# EAGLE design gameboy_esp_osc (EAGLE 8.4.3)
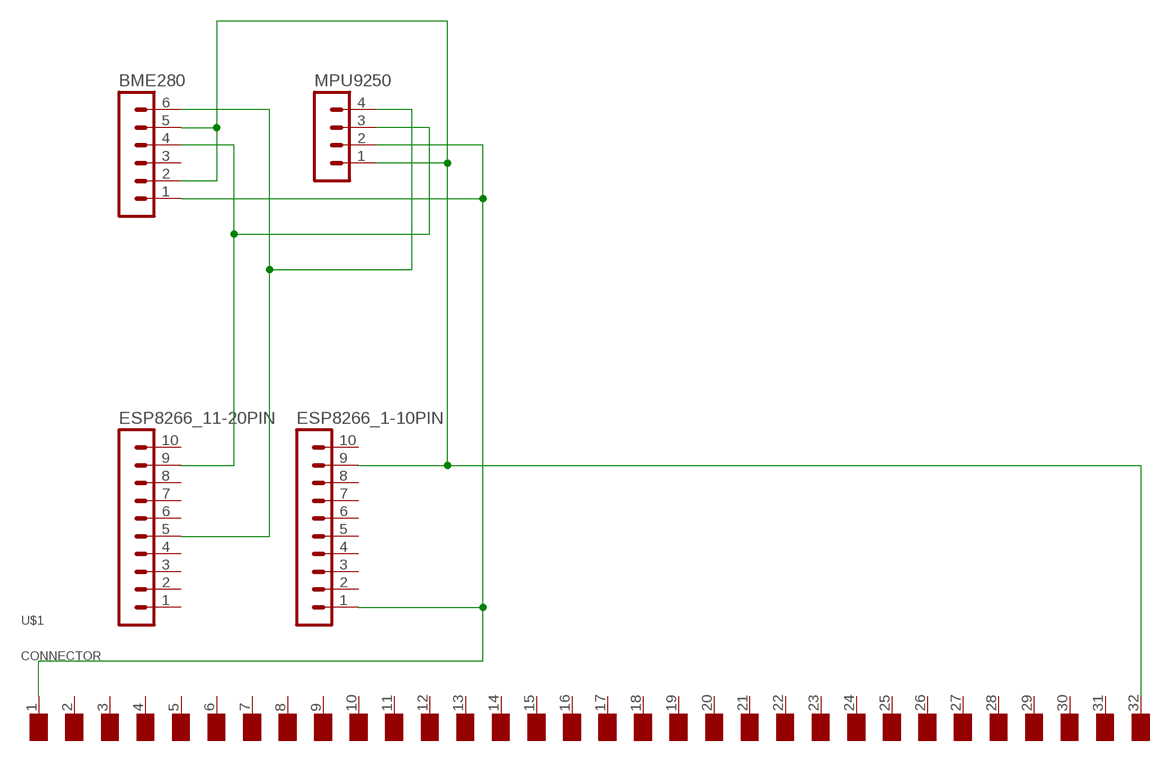
[diagram p0: schematic, sheet 1]

## Parts
BME280  MA06-1  [MA06-1]
ESP8266_1-10PIN  MA10-1  [MA10-1]
ESP8266_11-20PIN  MA10-1  [MA10-1]
MPU9250  MA04-1  [MA04-1]
U$1  CONNECTOR  [CONNECTOR]

## Nets
N$1: BME280.1 ESP8266_1-10PIN.1 MPU9250.2 U$1.1(VDD)
N$2: BME280.2 BME280.5 ESP8266_1-10PIN.9 MPU9250.1 U$1.32(GND)
N$3: BME280.4 ESP8266_11-20PIN.9 MPU9250.3
N$4: BME280.6 ESP8266_11-20PIN.5 MPU9250.4
Unconnected: BME280.3 ESP8266_1-10PIN.2 ESP8266_1-10PIN.3 ESP8266_1-10PIN.4 ESP8266_1-10PIN.5 ESP8266_1-10PIN.6 ESP8266_1-10PIN.7 ESP8266_1-10PIN.8 ESP8266_1-10PIN.10 ESP8266_11-20PIN.1 ESP8266_11-20PIN.2 ESP8266_11-20PIN.3 ESP8266_11-20PIN.4 ESP8266_11-20PIN.6 ESP8266_11-20PIN.7 ESP8266_11-20PIN.8 ESP8266_11-20PIN.10 U$1.2(NC) U$1.3(/WR) U$1.4(/RD) U$1.5(/RCS) U$1.6(A0) U$1.7(A1) U$1.8(A2) U$1.9(A3) U$1.10(A4) U$1.11(A5) U$1.12(A6) U$1.13(A7) U$1.14(A8) U$1.15(A9) U$1.16(A10) U$1.17(A11) U$1.18(A12) U$1.19(A13) U$1.20(A14) U$1.21(A15) U$1.22(D0) U$1.23(D1) U$1.24(D2) U$1.25(D3) U$1.26(D4) U$1.27(D5) U$1.28(D6) U$1.29(D7) U$1.30(/RS) U$1.31(VIN)

## Library data of the parts
BME280 = con-lstb:MA06-1: PIN HEADER; OC_FARNELL: unknown; OC_NEWARK: unknown
ESP8266_1-10PIN ESP8266_11-20PIN = con-lstb:MA10-1: PIN HEADER; OC_FARNELL: unknown; OC_NEWARK: unknown
MPU9250 = con-lstb:MA04-1: PIN HEADER; OC_FARNELL: unknown; OC_NEWARK: unknown
U$1 = gameboy:CONNECTOR: Connector Pads for Gameboy Cartridges

## Board
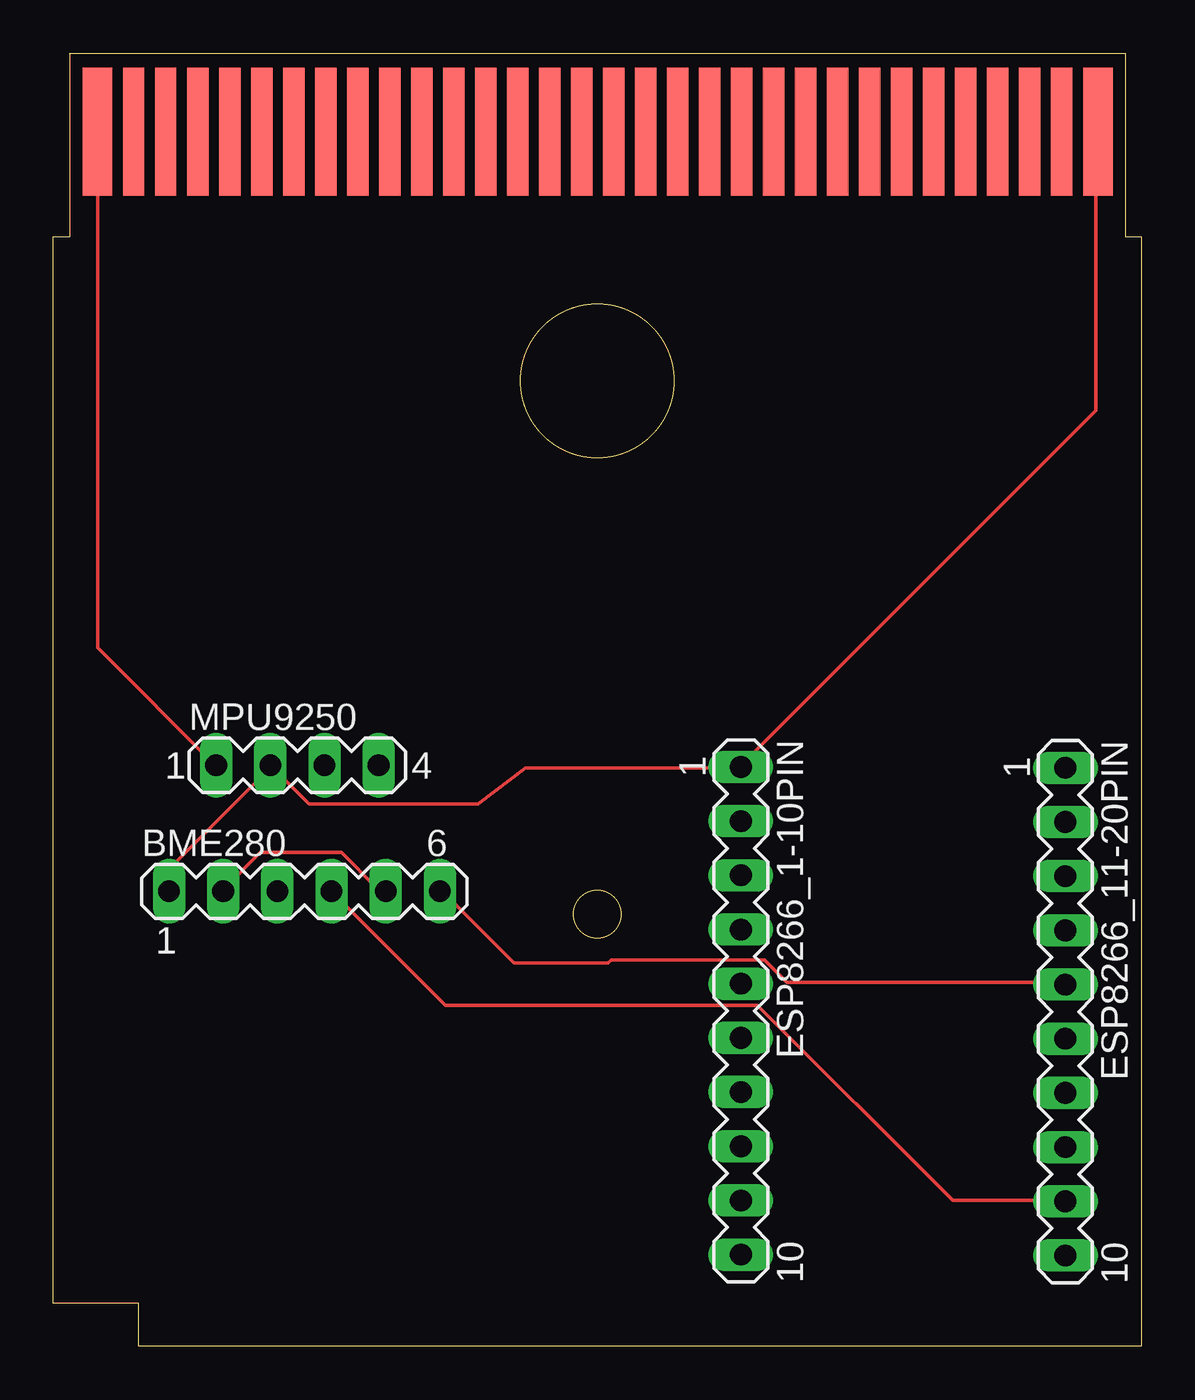
[diagram p1: board, top side]
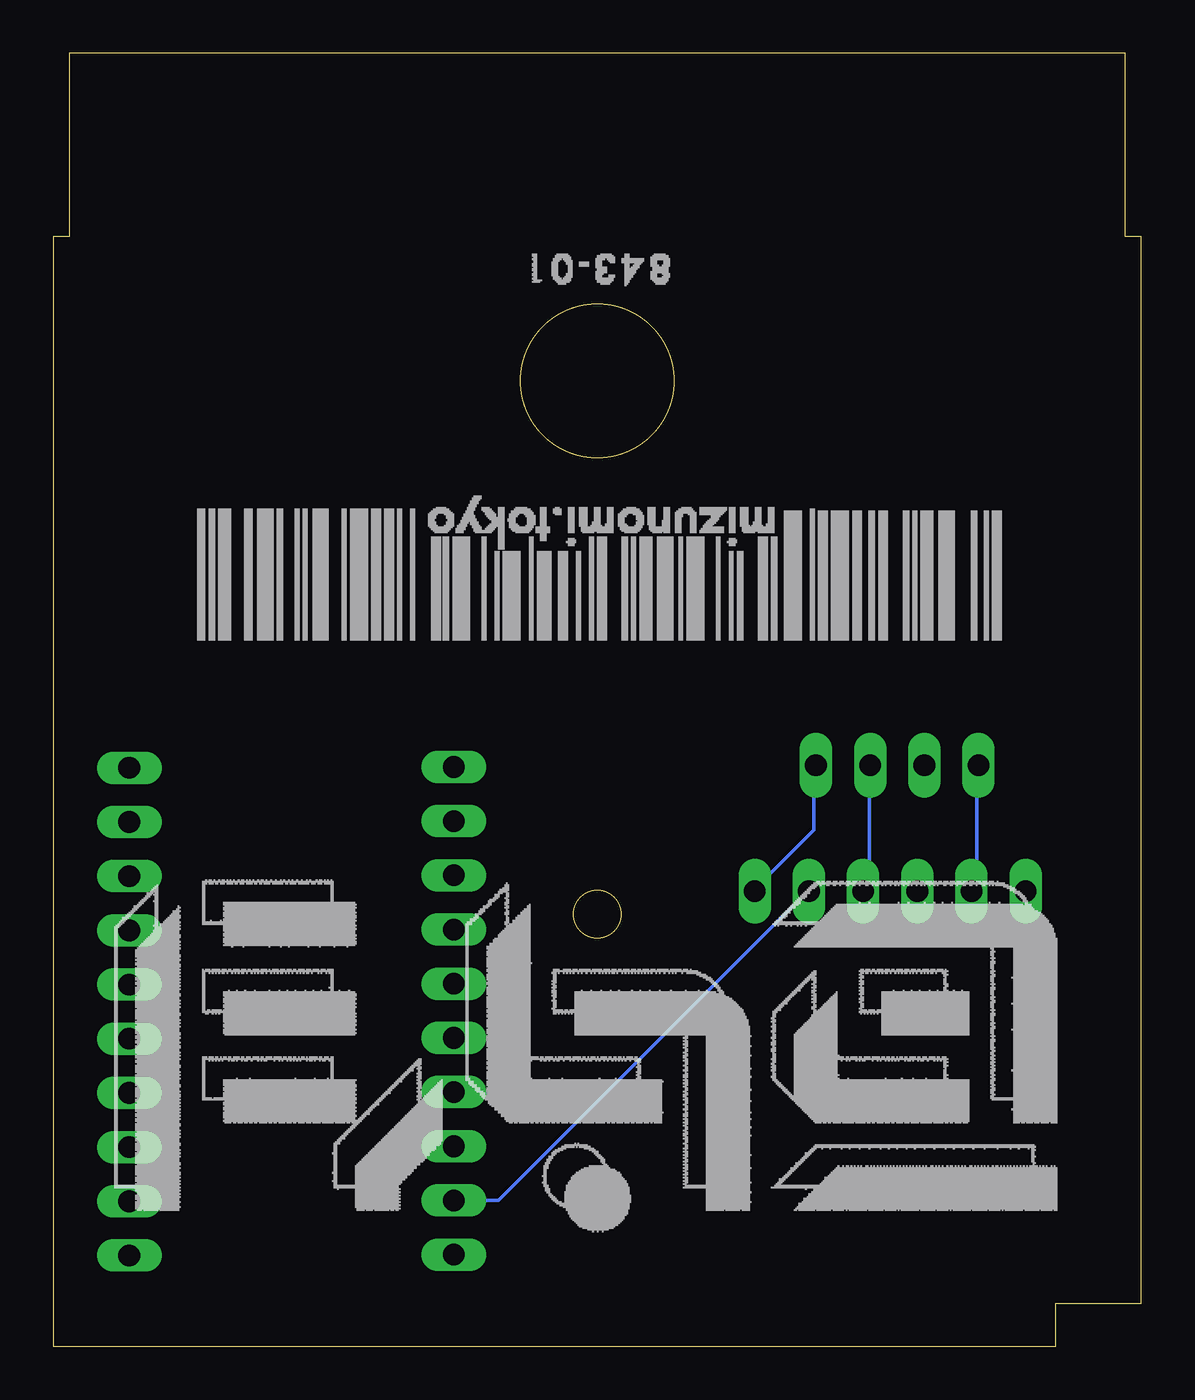
[diagram p2: board, bottom side, seen from below]

Size 51 x 60.6 mm. Coordinates in mm from the lower left corner, seen from the top.
Outline: 0.75,60.6 50.25,60.6 50.25,52 51,52 51,0 4,0 4,2 0,2 0,52 0.77,52 0.77,60.58
Outline: circle at 25.5,20.25 radius 1.12
Outline: circle at 25.5,45.25 radius 3.6
Copper layers (1*16): Top 0.035mm / dielectric 1.5mm / Bottom 0.035mm
Design rules "default": minimum track width 6mil, minimum drill 0.35mm, track to track 6mil, track to pad 6mil, pad to pad 6mil, via to via 6mil, smd to smd 6mil, copper to edge 40mil, drill to drill 6mil, minimum pad ring 10mil, minimum via ring 8mil, stop-mask expansion 4mil, vias tented up to drill 0mil, thermal gap 10mil

### Footprints (pad centres in the part's own frame; a part is rotated, then mirrored left to right if it is on the bottom)
MA06-1 = drill 1.016 long: 1 -6.35,0; 2 -3.81,0; 3 -1.27,0; 4 1.27,0; 5 3.81,0; 6 6.35,0
MA10-1 = drill 1.016 long: 1 -11.43,0; 2 -8.89,0; 3 -6.35,0; 4 -3.81,0; 5 -1.27,0; 6 1.27,0; 7 3.81,0; 8 6.35,0; 9 8.89,0; 10 11.43,0
MA04-1 = drill 1.016 long: 1 -3.81,0; 2 -1.27,0; 3 1.27,0; 4 3.81,0
CONNECTOR = smd 1.4 x 6: 1 0.7,-3; 32 47.6,-3 | smd 1 x 6: 2 2.4,-3; 3 3.9,-3; 4 5.4,-3; 5 6.9,-3; 6 8.4,-3; 7 9.9,-3; 8 11.4,-3; 9 12.9,-3; 10 14.4,-3; 11 15.9,-3; 12 17.4,-3; 13 18.9,-3; 14 20.4,-3; 15 21.9,-3; 16 23.4,-3; 17 24.9,-3; 18 26.4,-3; 19 27.9,-3; 20 29.4,-3; 21 30.9,-3; 22 32.4,-3; 23 33.9,-3; 24 35.4,-3; 25 36.9,-3; 26 38.4,-3; 27 39.9,-3; 28 41.4,-3; 29 42.9,-3; 30 44.4,-3; 31 45.9,-3

### Placement (x,y rotation side)
BME280  11.77,21.32 0 top
ESP8266_1-10PIN  32.23,15.72 270 top
ESP8266_11-20PIN  47.44,15.68 270 top
MPU9250  11.44,27.23 0 top
U$1  49.67,53.92 180 top

### Tracks (layer width: path | path; a pad name or v marks a point on that pad's centre or on a via)
N$1
  Top 0.152: BME280.1 5.43,21.46 5.43,22.38 10.16,27.1 MPU9250.2 10.31,27.1 11.99,25.42 19.91,25.42 22.13,27.1 32.1,27.1 ESP8266_1-10PIN.1 32.26,27.25 48.87,43.86 48.87,56.82 U$1.1
N$2
  Top 0.152: BME280.5 15.49,21.46 15.19,21.46 13.51,23.14 9.7,23.14 8.02,21.46 BME280.2 | U$1.32 2.08,56.82 2.08,32.74 7.57,27.25 MPU9250.1
  Bottom 0.152: MPU9250.1 7.72,27.1 7.72,21.61 7.87,21.46 BME280.2 | ESP8266_1-10PIN.9 32.1,6.83 30.12,6.83 15.64,21.31 BME280.5
N$3
  Top 0.152: ESP8266_11-20PIN.9 47.34,6.83 42.16,6.83 33.02,15.97 18.39,15.97 13.05,21.31 BME280.4
  Bottom 0.152: MPU9250.3 12.75,27.1 12.75,21.61 12.9,21.46 BME280.4
N$4
  Top 0.152: ESP8266_11-20PIN.5 47.34,17.04 34.39,17.04 33.32,18.11 26.16,18.11 26.01,17.96 21.59,17.96 18.23,21.31 BME280.6
  Bottom 0.152: MPU9250.4 15.34,27.1 15.34,24.2 18.08,21.46 BME280.6